# EAGLE design Procesor-Atmega32u4 (EAGLE 9.4.0)
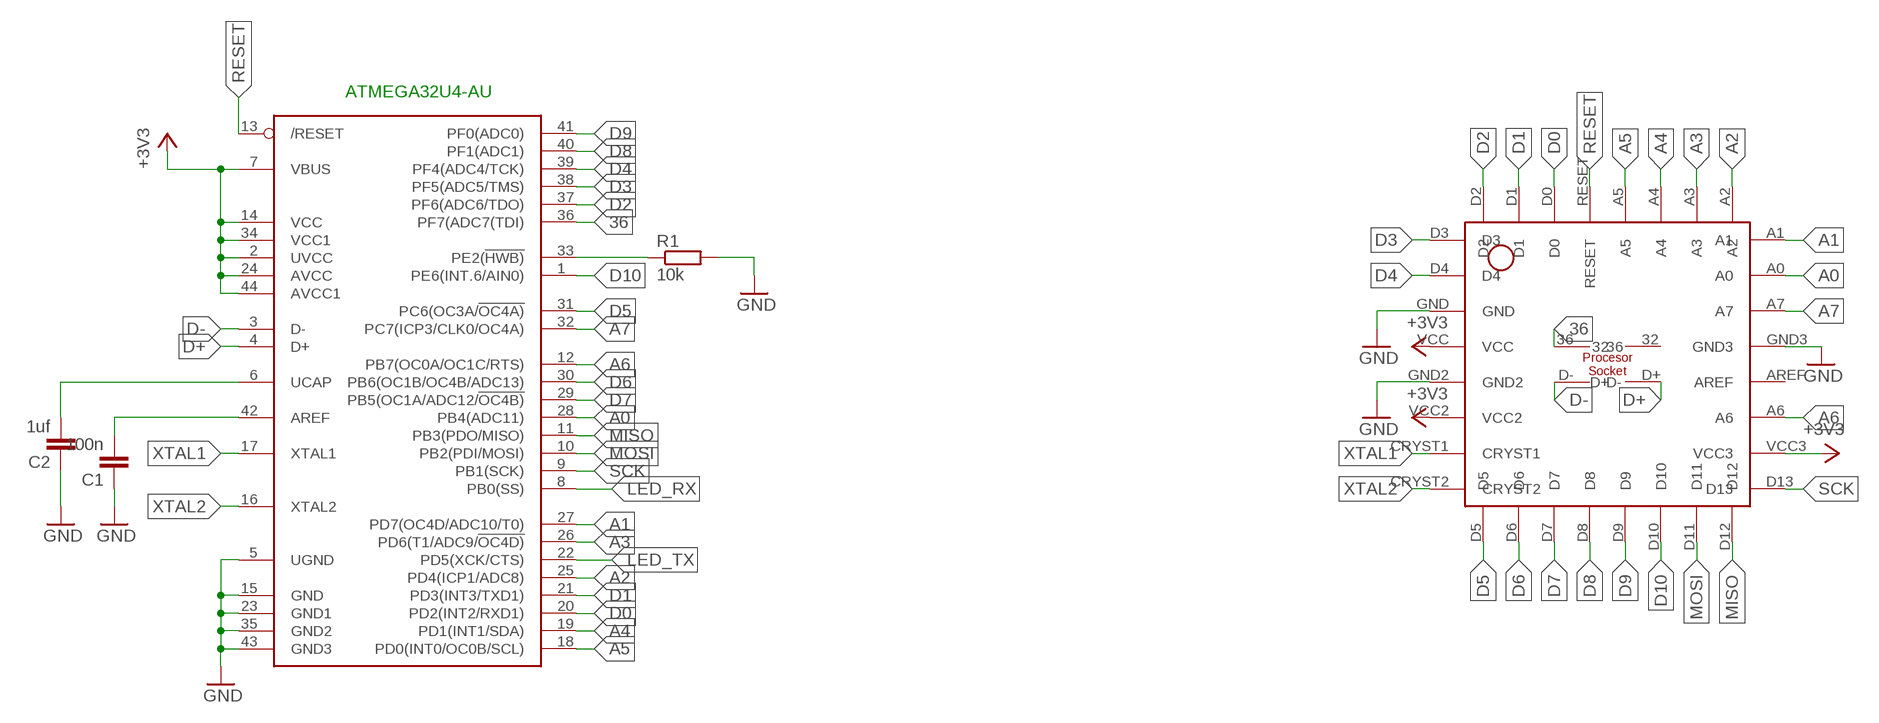
[diagram p0: schematic, sheet 1]

## Parts
ATMEGA32U4-AU  ATMEGA32U4-AU  [TQFP44]
C1  100n  C-EUC1206  [C1206]
C2  1uf  C-EUC1206K  [C1206K]
R1  10k  R-EU_R1206  [R1206]
U$2  PROCESSOR-SOCKET  [PROCESOR]

## Nets
36: ATMEGA32U4-AU.36(PF7(ADC7(TDI)) U$2.36
+3V3: ATMEGA32U4-AU.2(UVCC) ATMEGA32U4-AU.7(VBUS) ATMEGA32U4-AU.14(VCC) ATMEGA32U4-AU.24(AVCC) ATMEGA32U4-AU.34(VCC1) ATMEGA32U4-AU.44(AVCC1) U$2.VCC U$2.VCC2 U$2.VCC3
A0: ATMEGA32U4-AU.28(PB4(ADC11)) U$2.A0
A1: ATMEGA32U4-AU.27(PD7(OC4D/ADC10/T0)) U$2.A1
A2: ATMEGA32U4-AU.25(PD4(ICP1/ADC8)) U$2.A2
A3: ATMEGA32U4-AU.26(PD6(T1/ADC9/!OC4D)) U$2.A3
A4: ATMEGA32U4-AU.19(PD1(INT1/SDA)) U$2.A4
A5: ATMEGA32U4-AU.18(PD0(INT0/OC0B/SCL)) U$2.A5
A6: ATMEGA32U4-AU.12(PB7(OC0A/OC1C/RTS)) U$2.A6
A7: ATMEGA32U4-AU.32(PC7(ICP3/CLK0/OC4A)) U$2.A7
D0: ATMEGA32U4-AU.20(PD2(INT2/RXD1)) U$2.D0
D1: ATMEGA32U4-AU.21(PD3(INT3/TXD1)) U$2.D1
D2: ATMEGA32U4-AU.37(PF6(ADC6/TDO)) U$2.D2
D3: ATMEGA32U4-AU.38(PF5(ADC5/TMS)) U$2.D3
D4: ATMEGA32U4-AU.39(PF4(ADC4/TCK)) U$2.D4
D5: ATMEGA32U4-AU.31(PC6(OC3A/!OC4A)) U$2.D5
D6: ATMEGA32U4-AU.30(PB6(OC1B/OC4B/ADC13)) U$2.D6
D7: ATMEGA32U4-AU.29(PB5(OC1A/ADC12/!OC4B)) U$2.D7
D8: ATMEGA32U4-AU.40(PF1(ADC1)) U$2.D8
D9: ATMEGA32U4-AU.41(PF0(ADC0)) U$2.D9
D10: ATMEGA32U4-AU.1(PE6(INT.6/AIN0)) U$2.D10
D+: ATMEGA32U4-AU.4(D+) U$2.D+
D-: ATMEGA32U4-AU.3(D-) U$2.D-
GND: ATMEGA32U4-AU.5(UGND) ATMEGA32U4-AU.15(GND) ATMEGA32U4-AU.23(GND1) ATMEGA32U4-AU.35(GND2) ATMEGA32U4-AU.43(GND3) C1.1 C2.1 R1.2 U$2.GND U$2.GND2 U$2.GND3
LED_RX: ATMEGA32U4-AU.8(PB0(SS))
LED_TX: ATMEGA32U4-AU.22(PD5(XCK/CTS))
MISO: ATMEGA32U4-AU.11(PB3(PDO/MISO)) U$2.D12
MOSI: ATMEGA32U4-AU.10(PB2(PDI/MOSI)) U$2.D11
N$1: ATMEGA32U4-AU.42(AREF) C1.2
N$2: ATMEGA32U4-AU.6(UCAP) C2.2
N$6: ATMEGA32U4-AU.33(PE2(!HWB)) R1.1
RESET: ATMEGA32U4-AU.13(/RESET) U$2.RESET
SCK: ATMEGA32U4-AU.9(PB1(SCK)) U$2.D13
XTAL1: ATMEGA32U4-AU.17(XTAL1) U$2.CRYST1
XTAL2: ATMEGA32U4-AU.16(XTAL2) U$2.CRYST2
Unconnected: U$2.32 U$2.AREF

## Notes on the sheet
- ATMEGA32U4-AU

## Library data of the parts
ATMEGA32U4-AU = adafruit:ATMEGA32U4: http://www.ladyada.net/library/eagle
C1 C2 = rcl:C-EU: CAPACITOR, European symbol; SPICEPREFIX: C
R1 = rcl:R-EU_: RESISTOR, European symbol; SPICEPREFIX: R
U$2 = Cing Library:PROCESSOR-SOCKET

## Board
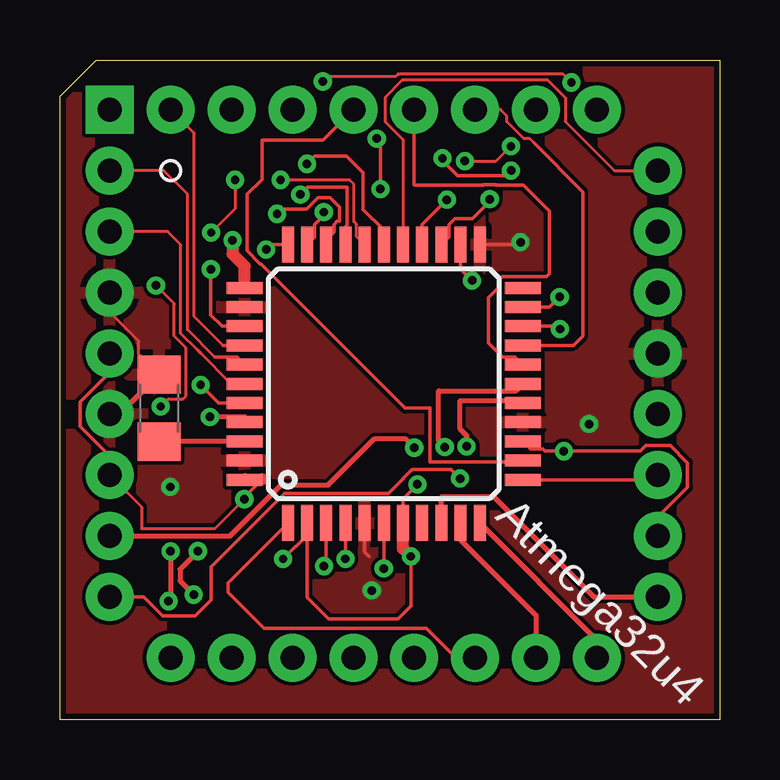
[diagram p1: board, top side]
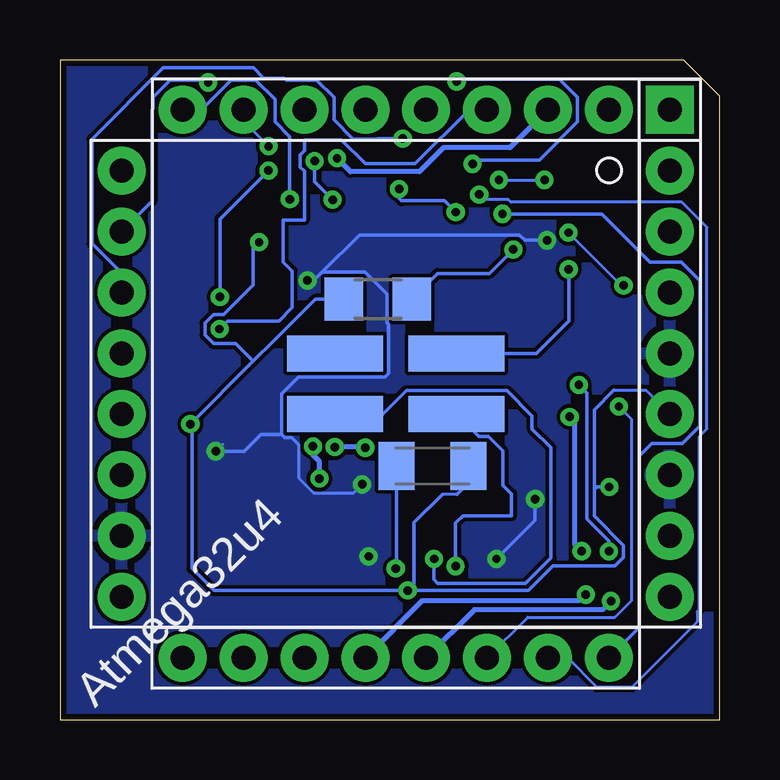
[diagram p2: board, bottom side, seen from below]

Size 27.5 x 27.5 mm. Coordinates in mm from the lower left corner, seen from the top.
Outline: 0,26 1.5,27.5 27.5,27.5 27.5,0 0,0 0,26
Copper layers (1*16): Top 0.035mm / dielectric 1.5mm / Bottom 0.035mm
Design rules "default *": minimum track width 5mil, minimum drill 0.35mm, track to track 6mil, track to pad 6mil, pad to pad 6mil, via to via 6mil, smd to smd 6mil, copper to edge 10mil, drill to drill 6mil, minimum pad ring 10mil, minimum via ring 8mil, stop-mask expansion 4mil, vias tented up to drill 0mil, thermal gap 10mil

### Footprints (pad centres in the part's own frame; a part is rotated, then mirrored left to right if it is on the bottom)
TQFP44 = smd 1.5 x 0.5: 1 -5.8,4; 2 -5.8,3.2; 3 -5.8,2.4; 4 -5.8,1.6; 5 -5.8,0.8; 6 -5.8,0; 7 -5.8,-0.8; 8 -5.8,-1.6; 9 -5.8,-2.4; 10 -5.8,-3.2; 11 -5.8,-4; 23 5.8,-4; 24 5.8,-3.2; 25 5.8,-2.4; 26 5.8,-1.6; 27 5.8,-0.8; 28 5.8,0; 29 5.8,0.8; 30 5.8,1.6; 31 5.8,2.4; 32 5.8,3.2; 33 5.8,4 | smd 0.5 x 1.5: 12 -4,-5.8; 13 -3.2,-5.8; 14 -2.4,-5.8; 15 -1.6,-5.8; 16 -0.8,-5.8; 17 0,-5.8; 18 0.8,-5.8; 19 1.6,-5.8; 20 2.4,-5.8; 21 3.2,-5.8; 22 4,-5.8; 34 4,5.8; 35 3.2,5.8; 36 2.4,5.8; 37 1.6,5.8; 38 0.8,5.8; 39 0,5.8; 40 -0.8,5.8; 41 -1.6,5.8; 42 -2.4,5.8; 43 -3.2,5.8; 44 -4,5.8
C1206 = smd 1.6 x 1.8: 1 -1.4,0; 2 1.4,0
C1206K = smd 1.5 x 2: 1 -1.5,0; 2 1.5,0
R1206 = smd 1.6 x 1.803: 1 -1.422,0; 2 1.422,0
PROCESOR = smd 4 x 1.5 bottom: 32 2.54,1.27; 36 -2.54,1.27; D+ 2.54,-1.27; D- -2.54,-1.27 | drill 1 pad 2: A0 11.43,6.35; A1 11.43,8.89; A2 8.89,11.43; A3 6.35,11.43; A4 3.81,11.43; A5 1.27,11.43; A6 11.43,-3.81; A7 11.43,3.81; AREF 11.43,-1.27; CRYST1 -11.43,-6.35; CRYST2 -11.43,-8.89; D0 -3.81,11.43; D1 -6.35,11.43; D2 -8.89,11.43; D3 -11.43,8.89; D4 -11.43,6.35; D5 -8.89,-11.43; D6 -6.35,-11.43; D7 -3.81,-11.43; D8 -1.27,-11.43; D9 1.27,-11.43; D10 3.81,-11.43; D11 6.35,-11.43; D12 8.89,-11.43; D13 11.43,-8.89; GND -11.43,3.81; GND2 -11.43,-1.27; GND3 11.43,1.27; RESET -1.27,11.43; VCC -11.43,1.27; VCC2 -11.43,-3.81; VCC3 11.43,-6.35 | drill 1 pad 2 square: P$1 -11.43,11.43

### Placement (x,y rotation side)
ATMEGA32U4-AU  13.5,14 90 top
C1  4.14,12.98 270 top
C2  11.98,10.57 180 bottom
R1  14.25,17.53 180 bottom
U$2  13.5,14 0 top

### Tracks (layer width: path | path; a pad name or v marks a point on that pad's centre or on a via)
36  (via drill 0.35)
  Top 0.152: v6.29,18.77 6.29,16.87 6.76,16.4 ATMEGA32U4-AU.36
  Bottom 0.152: v6.29,18.77 6.29,16.61 7.63,15.27 U$2.36
+3V3  (via drill 0.35, 0.35 pad 0.6)
  Top 0.127: U$2.VCC2 3.4,8.86 3.4,7.97 6.47,7.97 v7.69,9.19
  Top 0.152: 8.42,10.02 7.69,9.29 v7.69,9.19 | U$2.VCC 2.07,14.47 0.84,13.24 0.84,12.22 2.07,10.99 U$2.VCC2 | v14.63,6.8 14.63,4.73 14.1,4.2 11.2,4.2 10.3,5.1 ATMEGA32U4-AU.2 10.3,7.68 9.85,7.22 9.82,7.22 v9.3,6.7 | v14.9,9.81 14.3,9.21 ATMEGA32U4-AU.7 | ATMEGA32U4-AU.14 19.62,11.28 20.14,11.28 20.22,11.2 v21.02,11.2 24.2,11.2 24.42,11.42 25.44,11.42 26.16,10.7 26.16,9.68 24.93,8.45 U$2.VCC3 | ATMEGA32U4-AU.24 16.7,18.79 v17.18,18.31
  Top 0.2: 10.3,7.64 ATMEGA32U4-AU.2
  Top 0.508: ATMEGA32U4-AU.44 7.72,10.02 8.42,10.02 | v14.63,6.8 14.3,7.13 ATMEGA32U4-AU.7 | v21.02,11.2 v21.01,11.19 | v7.19,19.98 7.19,19.41 7.7,18.9 ATMEGA32U4-AU.34
  Bottom 0.127: v21.01,11.19 20.71,11.49 | 17.58,11.49 17.55,11.46 17.55,10.07 16.93,9.45 15.25,9.45 v14.9,9.81
  Bottom 0.152: 18.27,11.88 18.27,13.57 17.55,14.29 13.95,14.29 13.81,14.43 13.81,16.49 13.86,16.53 13.86,17.74 14.78,18.66 16.57,18.66 | 17.58,11.49 17.84,11.75 18.13,11.75 18.27,11.88 | 18.27,11.88 19.12,11.88 19.81,11.19 v21.01,11.19 | v17.18,18.31 16.92,18.31 16.57,18.66 | v9.3,6.7 7.69,8.31 v7.69,9.19 | v7.19,19.98 8.12,19.98 8.35,20.21 15.02,20.21 16.57,18.66
  pour Bottom: -1.74,-1.24 -1.74,29.24 28.74,29.24 28.74,-1.24
A0  (via drill 0.35)
  Top 0.127: v10.96,26.61 11.16,26.8 13.99,26.8 14.09,26.91 14.13,26.91 14.15,26.93 20.96,26.93 v21.32,26.56
  Top 0.152: v10.3,23.17 10.61,23.48 11.96,23.48 12.64,22.8 12.64,21.27 13.5,20.41 ATMEGA32U4-AU.28
  Bottom 0.152: U$2.A0 23.66,21.62 23.66,25.43 23.62,25.47 23.62,25.94 22.9,26.66 21.42,26.66 v21.32,26.56 | v10.3,23.17 10.3,23.33 7.51,23.33 5.92,24.92 5.92,25.94 6.69,26.7 10.86,26.7 v10.96,26.61
A1
  Top 0.127: U$2.A1 23.11,22.89 21.07,24.93 21.07,25.93 20.35,26.65 14.27,26.65 13.55,25.93 13.55,24.93 14.3,24.18 ATMEGA32U4-AU.27
A2  (via drill 0.35)
  Top 0.152: ATMEGA32U4-AU.25 16.22,20.12 16.22,20.64 16.47,20.89 17.19,20.89 17.92,21.62 v17.92,21.69
  Bottom 0.152: v17.92,21.69 17.92,24.3 18.54,24.92 18.54,25.86 19.34,26.66 20.36,26.66 21.59,25.43 U$2.A2
A3  (via drill 0.35)
  Top 0.127: v16.88,23.29 18.19,23.29 v18.8,23.9
  Top 0.152: ATMEGA32U4-AU.26 15.1,20.64 v16.13,21.67
  Bottom 0.127: v18.8,23.9 19.85,24.95 U$2.A3
  Bottom 0.152: v16.13,21.67 16.88,22.42 v16.88,23.29
A4
  Top 0.127: U$2.A4 18.37,25.43 18.63,25.17 18.63,24.93 19.35,24.21 19.59,24.21 19.75,24.05
  Top 0.152: ATMEGA32U4-AU.19 21.4,15.6 21.8,16 21.8,22 19.75,24.05
A5
  Top 0.152: ATMEGA32U4-AU.18 18.98,15.12 18.45,15.12 17.87,15.71 17.87,17.6 18.32,18.05 18.32,18.34 18.45,18.48 20.28,18.48 20.4,18.6 20.4,21.2 19.32,22.28 18.18,22.28 18.17,22.3 17.66,22.3 17.65,22.28 14.79,22.28 14.77,22.3 U$2.A5
A6
  Top 0.152: ATMEGA32U4-AU.12 24.74,10 U$2.A6
A7  (via drill 0.35)
  Top 0.152: ATMEGA32U4-AU.32 10.62,20.12 10.62,20.64 11,21.03 v11,21.16 | v13.36,22.12 13.36,24.07 v13.21,24.23
  Bottom 0.152: v11,21.16 11.48,21.63 13.26,21.63 13.36,21.73 v13.36,22.12 | v13.21,24.23 14.24,24.23 14.26,24.2 15.28,24.2 16.08,25 16.08,25.94 16.8,26.66 18.06,26.66 18.15,26.75 19,26.75 19.42,27.17 23.19,27.17 26.16,24.2 26.16,19.84 24.93,18.61 U$2.A7
D0  (via drill 0.35)
  Top 0.152: ATMEGA32U4-AU.20 20.73,16.4 v20.85,16.28
  Bottom 0.152: v20.85,16.28 20.52,16.61 18.38,16.61 17.82,17.17 17.82,18.7 18.2,19.08 18.2,20.83 17.31,20.83 17.31,22.86 17.49,23.04 17.49,23.54 17.31,23.71 17.31,24.16 15.76,24.16 14.77,23.17 12.69,23.17 10.43,25.43 U$2.D0
D1  (via drill 0.35)
  Top 0.152: v20.83,17.62 20.41,17.2 ATMEGA32U4-AU.21 | v18.81,22.89 18.6,22.68 16.57,22.68 15.95,23.3 v15.95,23.4
  Bottom 0.152: v20.83,17.62 20.83,20.87 v18.81,22.89
  Bottom 0.203: U$2.D1 8.74,23.84 11.52,23.84 12.52,22.84 15.39,22.84 v15.95,23.4
D2
  Top 0.127: 6.8,15.6 5.6,16.8 5.6,24.44 U$2.D2
  Top 0.152: ATMEGA32U4-AU.37 6.8,15.6
D3
  Top 0.127: 6.45,15.12 5.32,16.25 5.32,21.9 4.33,22.89 U$2.D3
  Top 0.152: ATMEGA32U4-AU.38 7.38,15.12 6.45,15.12
D4
  Top 0.127: 7.14,14 5.87,15.28 | 5.73,15.41 5.04,16.1 5.04,19.8 4.49,20.35 U$2.D4
  Top 0.152: 5.87,15.28 5.73,15.41 | ATMEGA32U4-AU.39 7.14,14
D5  (via drill 0.35)
  Top 0.152: ATMEGA32U4-AU.31 11.1,20.01 11.42,20.33 11.42,20.64 11.55,20.78 11.65,20.78 11.65,21.36 11.25,21.76 10.75,21.76 10.27,21.28 9.25,21.28 v9.05,21.08
  Bottom 0.152: U$2.D5 3.34,3.84 3.34,10.99 2.83,11.5 1.56,11.5 0.82,12.24 0.82,18.3 1.6,19.08 2.9,19.08 4.9,21.08 v9.05,21.08
D6  (via drill 0.35)
  Top 0.152: ATMEGA32U4-AU.30 11.9,20.56 11.96,20.62 11.96,22.2 10.33,22.2 v10.02,21.89
  Bottom 0.127: U$2.D6 6.33,2.57 5.11,1.35 4.1,1.35 3.66,1.35 0.93,4.08 0.93,4.49 0.84,4.58 0.84,11.81 0.53,12.12 0.53,20.53 1.35,21.35 1.57,21.57 8.7,21.57 8.81,21.68 9.8,21.68 v10.02,21.89
D7  (via drill 0.35)
  Top 0.127: ATMEGA32U4-AU.29 12.37,20.13 12.37,20.64 12.25,20.75 12.25,22.32 12.08,22.49 v9.21,22.49 v9.2,22.5 | v7.3,22.5 7.3,21.3 v6.3,20.3 | v4.2,13.05 4.52,13.37 5.13,13.37 5.25,13.49 5.25,15.5 4.76,15.99 4.76,17.34 v4,18.1
  Bottom 0.127: U$2.D7 8,4.26 4.36,4.26 3.66,4.96 3.66,12.51 v4.2,13.05 | v9.2,22.5 v7.3,22.5 | v4,18.1 4.1,18.1 v6.3,20.3
D8  (via drill 0.35 pad 0.6)
  Top 0.152: v5.86,13.95 6.62,13.2 ATMEGA32U4-AU.40
  Top 0.203: v4.53,4.94 4.61,5.02 v4.61,7.01
  Bottom 0.152: v4.61,7.01 4.61,7.44 5.53,8.37 5.53,13.62 v5.86,13.95
  Bottom 0.203: v4.53,4.94 4.88,4.58 10.22,4.58 U$2.D8
D9  (via drill 0.35, 0.35 pad 0.6)
  Top 0.2: v5.58,5.21 5,5.79 5,6.27 v5.75,7.02
  Top 0.203: ATMEGA32U4-AU.41 7.7,12.62 v6.25,12.62
  Bottom 0.2: 8.32,4.96 5.83,4.96 v5.58,5.21
  Bottom 0.203: v6.25,12.62 6.04,12.41 6.04,7.31 v5.75,7.02 | 8.32,4.96 12.38,4.96 U$2.D9
D10
  Top 0.152: U$2.D10 16.51,2.57 15.28,3.8 8.5,3.8 7,5.3 7,5.7 ATMEGA32U4-AU.1
D+  (via drill 0.35)
  Top 0.152: ATMEGA32U4-AU.4 v11.9,6.7
  Bottom 0.152: U$2.D+ 14.03,12.73 13.05,13.71 8.87,13.71 7.81,12.66 7.81,12.12 7.03,11.34 7.03,6.75 8.09,5.69 11.75,5.69 11.9,5.84 v11.9,6.7
D-  (via drill 0.35)
  Top 0.152: ATMEGA32U4-AU.3 11.1,6.49 v11,6.39
  Bottom 0.152: U$2.D- 10.03,11.8 9.63,11.8 9.03,11.2 9.03,9.77 8.67,9.41 8.67,8.5 10.7,8.5 11,8.2 v11,6.39
GND  (via drill 0.35)
  Top 0.127: C1.1 3.29,15.23 3.29,15.77 2.07,16.99 U$2.GND
  Top 0.152: ATMEGA32U4-AU.23 19.1,19.8 v19.2,19.9 | ATMEGA32U4-AU.5 12.7,6.98 12.88,6.8
  Top 0.203: C1.1 2.48,12.73 U$2.GND2
  Bottom 0.127: U$2.GND2 3.07,13.73 4.4,13.73 | 10.94,9.39 11.55,9.39
  Bottom 0.152: 19.44,14.94 v22.06,12.32 22,12.26 22,6.3 21.08,5.38 v13,5.38 | 19.44,14.94 18.57,15.81 16.85,17.53 R1.2 | v13,5.38 7.97,5.38 6.94,6.41 4.36,6.41 4,6.76 4,7.27 5.22,8.48 5.22,9.6 | 11.55,9.39 12.13,8.81 12.15,8.81 12.73,8.23 12.73,5.65 v13,5.38 | 5.22,9.6 5.22,12.91 4.4,13.73 | C2.1 10.48,9.86 10.94,9.39 | 5.22,9.6 5.12,9.7 v4.6,9.7 | v19.2,19.9 19.44,19.66 19.44,18.12 20.67,16.89 21.1,16.89 21.46,16.53 21.46,16.03 21.1,15.67 20.17,15.67 19.44,14.94
  pour Top: -1.74,-1.24 -1.74,29.24 28.74,29.24 28.74,-1.24
MISO
  Top 0.203: ATMEGA32U4-AU.11 22.39,3.31 U$2.D12
MOSI
  Top 0.203: ATMEGA32U4-AU.10 16.7,7.5 19.85,4.35 U$2.D11
N$1
  Top 0.203: ATMEGA32U4-AU.42 4.15,11.6 C1.2
N$2  (via drill 0.35)
  Top 0.152: v13.5,6.3 ATMEGA32U4-AU.6
  Bottom 0.152: C2.2 13.48,6.32 v13.5,6.3
N$6  (via drill 0.35)
  Top 0.152: ATMEGA32U4-AU.33 8.8,19.8 v8.6,19.6
  Bottom 0.152: R1.1 11.76,18.6 9.6,18.6 v8.6,19.6
RESET
  Top 0.152: 19.24,10.74 15.42,10.74 15.42,12.98 14.39,12.98 8.38,18.99 8.35,18.99 7.8,19.54 7.8,21.9 8.42,22.52 8.42,24.16 10.96,24.16 U$2.RESET
  Top 0.203: ATMEGA32U4-AU.13 19.24,10.74
SCK
  Top 0.203: ATMEGA32U4-AU.9 15.91,8.21 15.91,9.3 18.07,9.3 22.26,5.11 U$2.D13
XTAL1  (via drill 0.35 pad 0.6)
  Top 0.203: U$2.CRYST1 7.09,7.65 9.22,9.78 11.19,9.78 13.12,11.71 14.39,11.71 v14.77,11.33 | ATMEGA32U4-AU.17 19,13.7 15.78,13.7 15.78,11.62 v16.04,11.36
  Bottom 0.203: v14.77,11.33 14.77,11.36 v16.04,11.36
XTAL2  (via drill 0.35 pad 0.6)
  Top 0.152: v16.68,10.05 16.29,10.44 14.71,10.44 14.69,10.41 14.65,10.41 14.29,10.06 14.29,10.02 13.7,9.43 9.37,9.43 6.3,6.36 6.3,5 5.63,4.33 4.28,4.33 3.5,5.11 U$2.CRYST2
  Top 0.203: ATMEGA32U4-AU.16 19.2,13.3 16.69,13.3 16.69,12.12 16.95,11.85 v16.95,11.39
  Bottom 0.203: v16.68,10.05 16.68,10.77 16.95,11.04 v16.95,11.39

### Text on the board
tPlace: Atmega32u4
bPlace: Atmega32u4